# Altium schematic sheet BMS_CellCircuit.SchDoc
size A
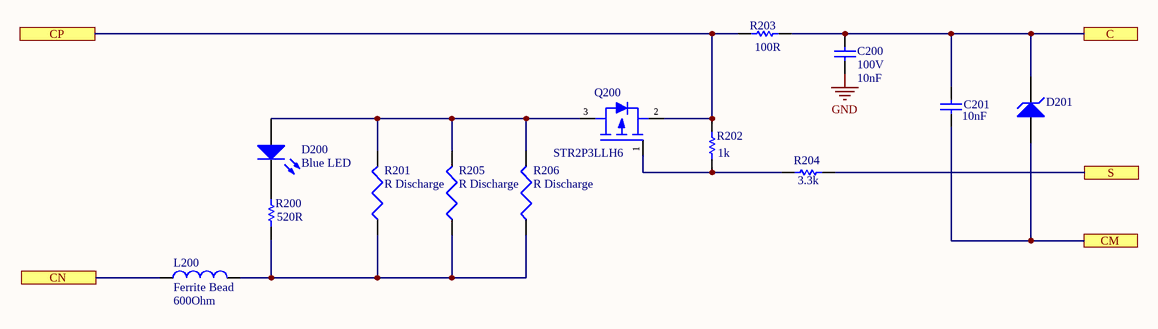
[diagram p0: BMS_CellCircuit.SchDoc]

## Parts
C200  100V  value 10nF  [CAPC2012X14N]
C201  value 10nF  [CAPC2012X14N]  (hidden comment: C0805)
D200  Blue LED  [SMD Blue LED]
D201  D Zener 6.8V  [SODFL250X110-2N]  (value not drawn)
L200  Ferrite Bead  value 600Ohm  [INDC3216X13N]
Q200  STR2P3LLH6  [SOT95P280X110-3N]
R200  value 520R  [RESC2012X07N]  (hidden comment: R0805)
R201  R Discharge  [RESC1632X06N]
R202  value 1k  [RESC2012X07N]  (hidden comment: R0805)
R203  value 100R  [RESC2012X07N]  (hidden comment: R0805)
R204  value 3.3k  [RESC2012X07N]  (hidden comment: R0805)
R205  R Discharge  [RESC1632X06N]
R206  R Discharge  [RESC1632X06N]

## Ports
C, CM, CN, CP, S

## Nets
GND: C200.2
C: C200.1 C201.1 D201.2(K) R203.1 ; port C
CM: C201.2 D201.1(A) ; port CM
CN: L200.1 ; port CN
CP: Q200.2 R202.2 R203.2 ; port CP
S: R204.1 ; port S
NetD200_1: D200.1(A) Q200.3 R201.2 R205.2 R206.2
NetD200_2: D200.2(K) R200.2
NetL200_2: L200.2 R200.1 R201.1 R205.1 R206.1
NetQ200_1: Q200.1 R202.1 R204.2

## Library data of the parts
C200 C201 = Cap: Capacitor; Published: 8-Jun-2000; LatestRevisionDate: 17-Jul-2002; LatestRevisionNote: Re-released for DXP Platform.; PackageReference: RAD-0.3; Publisher: Altium Limited; PackageDescription: Radial Cap, Thru-Hole; 2 Leads; 0.3 in Pin Spacing
D200 = LED0: Typical INFRARED GaAs LED; Published: 8-Jun-2000; LatestRevisionDate: 08-Jul-2005; LatestRevisionNote: Mech Layer 1 removed.; PackageReference: LED-0; Publisher: Altium Limited; PackageDescription: LED; 2 Leads
D201 = D Zener: Zener Diodes PDZ6.8B/SOD2/REEL 13" Q1/T1 *S; Published: 8-Jun-2000; LatestRevisionDate: 17-Jul-2002; LatestRevisionNote: Re-released for DXP Platform.; PackageReference: DIODE-0.7; Publisher: Altium Limited; PackageDescription: Diode, Thru-Hole; 2 Leads; 0.7 in Pin Spacing
L200 = Inductor: Code_IEC: 1005; Published: 8-Jun-2000; LatestRevisionDate: 29-May-2009; LatestRevisionNote: IPC-7351 Footprint Added.; PackageReference: 0402-A; Publisher: Altium Limited; PackageDescription: Chip Inductor; Code_JEITA: 0402
Q200 = STR2P3LLH6: P-channel -30 V, 48 mΩ typICAL, -2 A STripFET™ H6 Power MOSFET in a SOT-23 package.
R200 R202-R204 = Res1: Resistor; Published: 8-Jun-2000; LatestRevisionDate: 17-Jul-2002; LatestRevisionNote: Re-released for DXP Platform.; PackageReference: AXIAL-0.3; Publisher: Altium Limited; PackageDescription: Axial Device, Thru-Hole; 2 Leads; 0.3 in Pin Spacing
R201 R205 R206 = R Discharge: 0612 Discharge Resistance - WK73R2BTTD42R2F